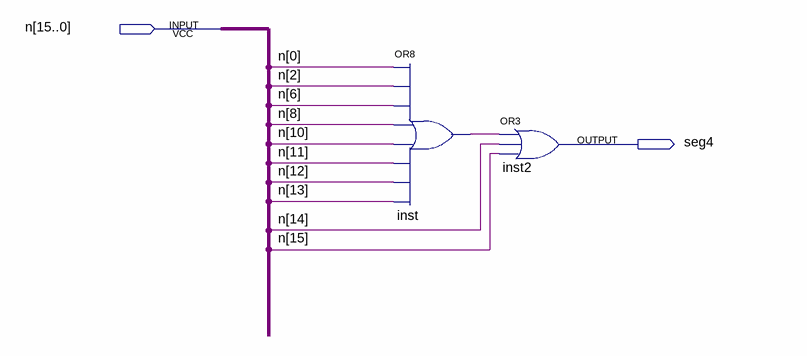
[diagram p0: schematic sheet]
// Quartus schematic seg4.bdf as structural Verilog: 2 symbols, 2 pins
module seg4 (
  input  [15:0] n,
  output seg4
);

  wire inst_out;

  or inst (inst_out, n[0], n[2], n[6], n[8], n[10], n[11], n[12], n[13]);
  or inst2 (seg4, inst_out, n[14], n[15]);
endmodule
